# EAGLE design EncAMT203_Cat6_180223 (EAGLE 7.7.0)
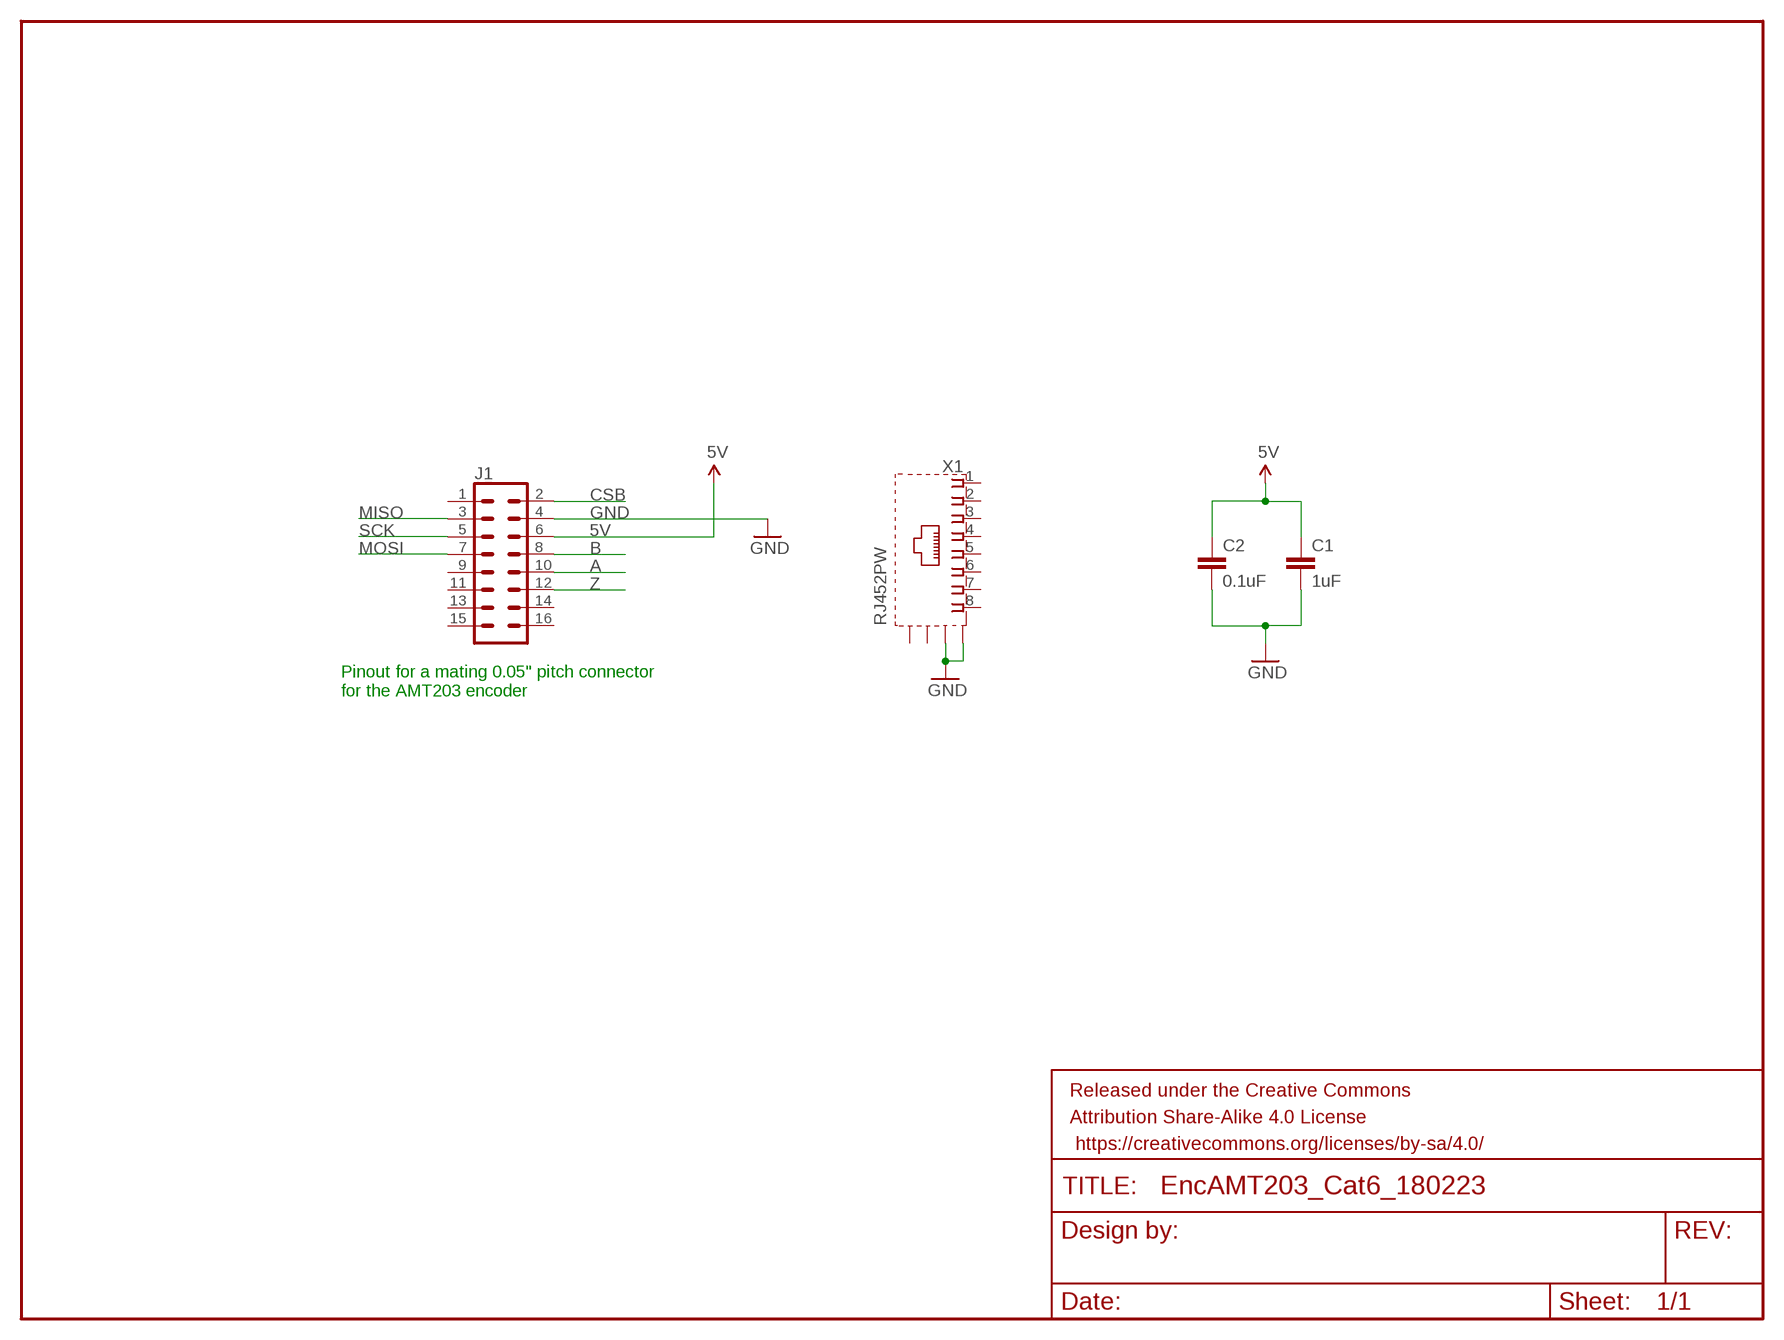
[diagram p0: schematic, sheet 1]

## Parts
C1  1uF  0.1UF-0603-25V-5%  [0603]
C2  0.1uF  0.1UF-0603-25V-5%  [0603]
FRAME1  FRAME-LETTERNO_PACKAGE  [DUMMY]
J1  CONN_08X2_1.27MM  [2X08_1.27MM]
X1  RJ452PW  [RJ45-SHIELD1]

## Nets
5V: C1.1 C2.1 J1.6
A: J1.10
B: J1.8
CSB: J1.2
GND: C1.2 C2.2 J1.4 X1.S1(S) X1.S2(S)
MISO: J1.3
MOSI: J1.7
SCK: J1.5
Z: J1.12
Unconnected: J1.1 J1.9 J1.11 J1.13 J1.14 J1.15 J1.16 X1.1 X1.2 X1.3 X1.4 X1.5 X1.6 X1.7 X1.8 X1.S3(S) X1.S4(S)

## Notes on the sheet
- Pinout for a mating 0.05" pitch connector
  for the AMT203 encoder

## Library data of the parts
C1 = SparkFun-Capacitors:0.1UF: 0.1µF ceramic capacitors A capacitor is a passive two-terminal electrical component used to store electrical energy temporarily in an electric field.; PROD_ID: CAP-08604; VALUE: 0.1uF
C2 = SparkFun-Capacitors:0.1UF: 0.1µF ceramic capacitors A capacitor is a passive two-terminal electrical component used to store electrical energy temporarily in an electric field.; PROD_ID: CAP-08604
FRAME1 = SparkFun-Aesthetics:FRAME-LETTER: Schematic Frame - Letter Standard 8.5x11 US Letter frame; DESIGNER: Nobody; VERSION: v01
J1 = !!Pat_030112:CONN_08X2: Multi connection point. Often used as Generic Header-pin footprint for 0.1 inch spaced/style header connections You can populate with any combo of single row headers, but if you'd like an exact match, check this: Header - 2x8 (Male, 0.1") <https://www.sparkfun.com/products/13156> (PRT-13156) On any of the 0.1 inch spaced packages, you can populate with these: Break Away Headers - Straight <https://www.sparkfun.com/products/116> (PRT-00116) Break Away Male Headers - Right Angle <https://www.sparkfun.com/products/553> (PRT-00553) Female Headers <https://www.sparkfun.com/products/115> (PRT-00115) Break Away Headers - Machine Pin <https://www.sparkfun.com/products/117> (PRT-00117) Break Away Female Headers - Swiss Machine Pin <https://www.sparkfun.com/products/743> (PRT-00743)
X1 = !!Pat_030112:RJ45*2: PAT Modified RJ45 Shield Type 1 For all RJ45 L, LC, LCT and X Series Models Tyco Electronics: 1734795-1

## Board
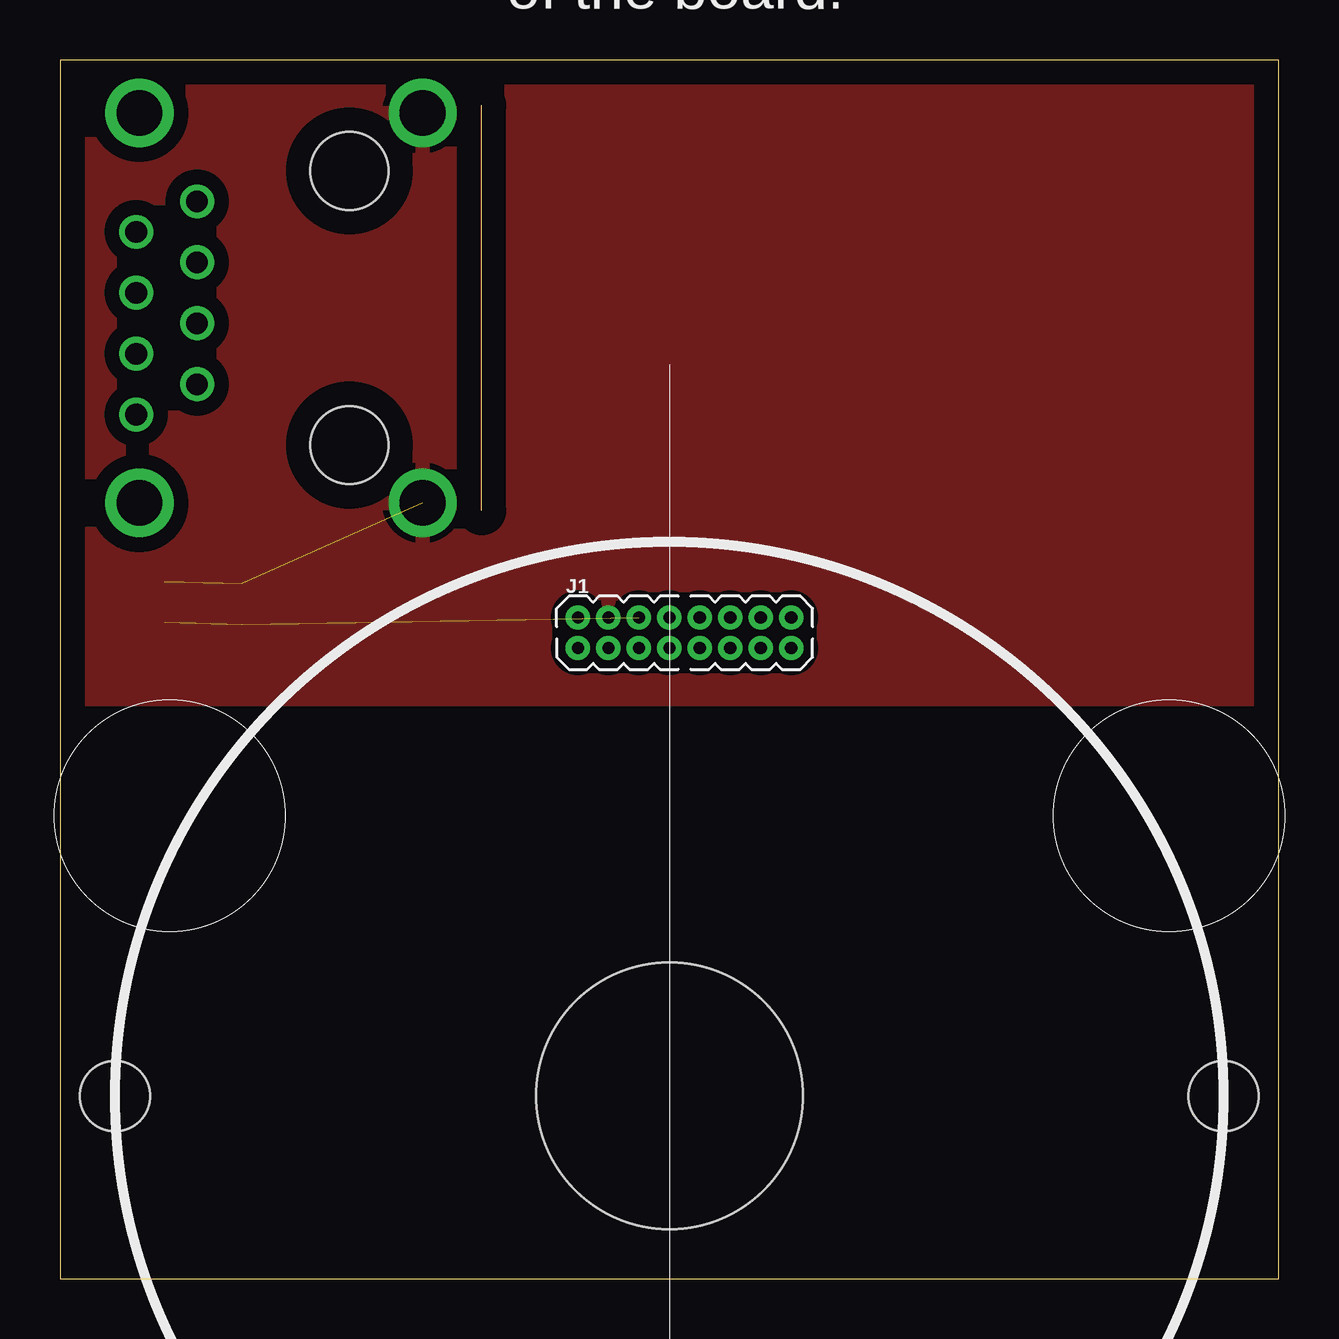
[diagram p1: board, top side]
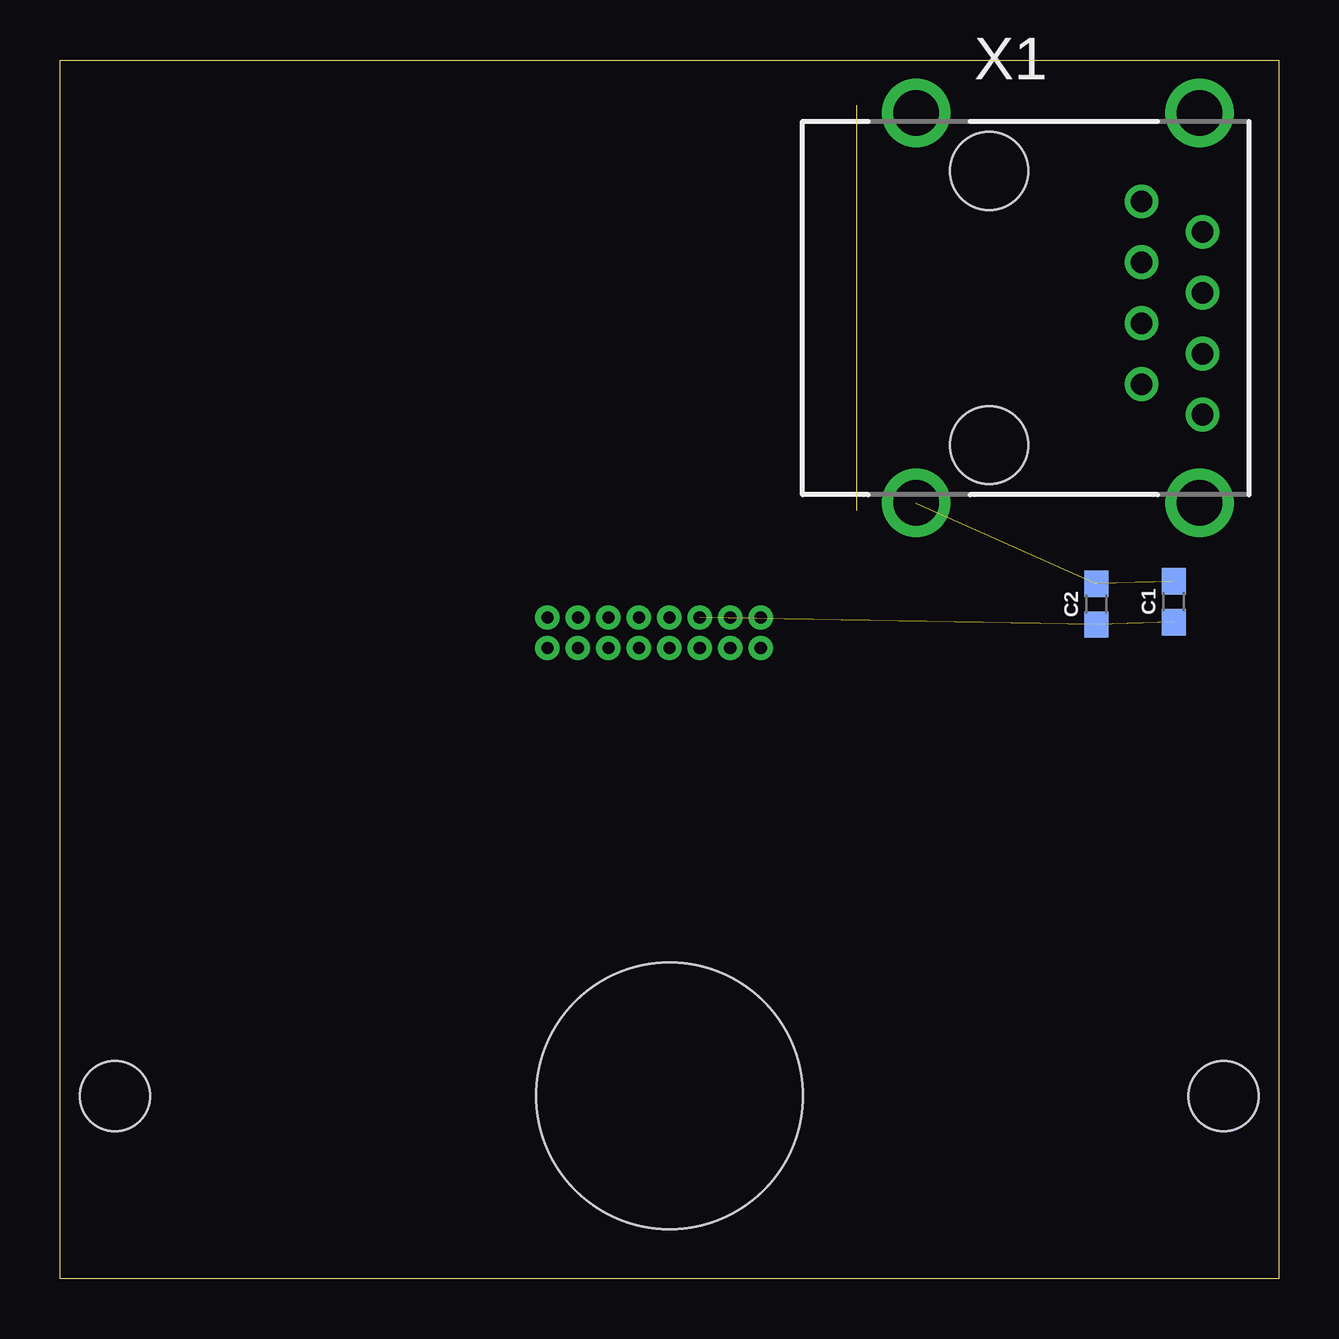
[diagram p2: board, bottom side, seen from below]

Size 50.8 x 50.8 mm. Coordinates in mm from the lower left corner, seen from the top.
Outline: 0,0 50.8,0 50.8,50.8 0,50.8 0,0
Copper layers (1*16): Top 0.035mm / dielectric 1.5mm / Bottom 0.035mm
Design rules "default": minimum track width 10mil, minimum drill 24mil, track to track 8mil, track to pad 8mil, pad to pad 8mil, via to via 8mil, smd to smd 8mil, copper to edge 40mil, drill to drill 8mil, minimum pad ring 10mil, minimum via ring 8mil, stop-mask expansion 4mil, vias tented up to drill 0mil, thermal gap 10mil
Holes 11.11 mm at 25.4,7.62
Holes 2.92 mm at 48.5,7.62 2.3,7.62

### Footprints (pad centres in the part's own frame; a part is rotated, then mirrored left to right if it is on the bottom)
0603 = smd 1.1 x 1: 1 -0.85,0; 2 0.85,0
2X08_1.27MM = drill 0.508 pad 1: 1 1.27,1.27; 2 1.27,2.54; 3 2.54,1.27; 4 2.54,2.54; 5 3.81,1.27; 6 3.81,2.54; 7 5.08,1.27; 8 5.08,2.54; 9 6.35,1.27; 10 6.35,2.54; 11 7.62,1.27; 12 7.62,2.54; 13 8.89,1.27; 14 8.89,2.54; 15 10.16,1.27; 16 10.16,2.54
RJ45-SHIELD1 = drill 0.9 pad 1.4: 1 -4.445,6.35; 2 -3.175,8.89; 3 -1.905,6.35; 4 -0.635,8.89; 5 0.635,6.35; 6 1.905,8.89; 7 3.175,6.35; 8 4.445,8.89 | drill 1.9 pad 2.5: S1 -8.128,-3.048; S2 8.128,-3.048; S3 -8.128,8.76; S4 8.128,8.76 | hole 3.251: -5.715,0; 5.715,0

### Placement (x,y rotation side)
C1  4.37,28.22 90 bottom
C2  7.59,28.12 90 bottom
FRAME1  -13.97,27.94 0 top  (outside the outline)
J1  20.32,25.02 0 top
X1  12.06,40.46 270 bottom

### Tracks (layer width: path | path; a pad name or v marks a point on that pad's centre or on a via)
5V  (2 unrouted)
GND  (2 unrouted)
  pour Top (isolate 0.61): 0.05,24.16 50.83,24.16 50.8,50.8 0,50.8

### Text on the board
tPlace: All parts on the back of the board, / the AMT203 is alwo on the back / of the board.